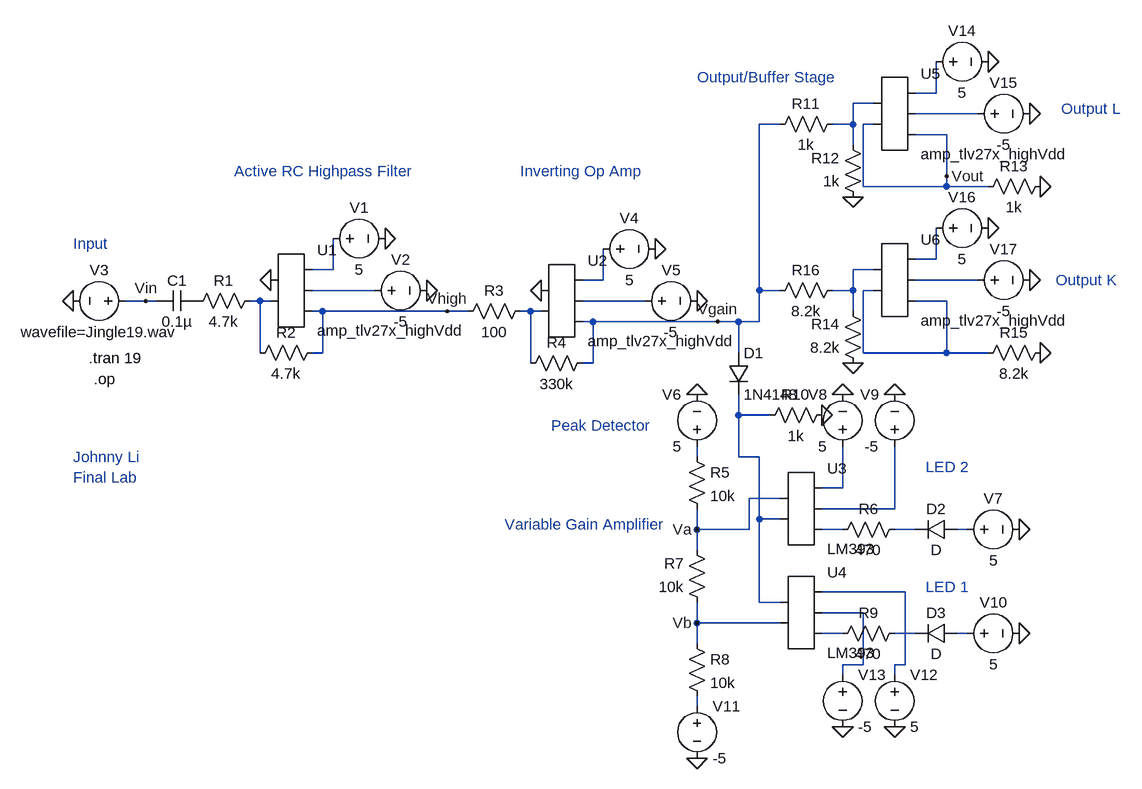
[diagram p0: schematic Lab10.asc]
Lab10.asc, the LTspice schematic file:
Version 4
SHEET 1 1748 968
WIRE 1264 -96 1264 -144
WIRE 1264 -96 1232 -96
WIRE 1168 -80 1136 -80
WIRE 1328 -64 1232 -64
WIRE 1024 -48 992 -48
WIRE 1136 -48 1136 -80
WIRE 1136 -48 1104 -48
WIRE 1168 -48 1152 -48
WIRE 1280 -32 1232 -32
WIRE 1136 -16 1136 -48
WIRE 1280 32 1280 -32
WIRE 1152 48 1152 -48
WIRE 1280 48 1280 32
WIRE 1280 48 1152 48
WIRE 1344 48 1280 48
WIRE 1264 160 1264 112
WIRE 1264 160 1232 160
WIRE 336 176 336 128
WIRE 336 176 304 176
WIRE 1168 176 1136 176
WIRE 752 192 752 144
WIRE 752 192 720 192
WIRE 1328 192 1232 192
WIRE 400 208 304 208
WIRE 992 208 992 -48
WIRE 1024 208 992 208
WIRE 1136 208 1136 176
WIRE 1136 208 1104 208
WIRE 1168 208 1152 208
WIRE 48 224 16 224
WIRE 64 224 48 224
WIRE 224 224 208 224
WIRE 240 224 224 224
WIRE 816 224 720 224
WIRE 1280 224 1232 224
WIRE 320 240 304 240
WIRE 512 240 320 240
WIRE 544 240 512 240
WIRE 640 240 624 240
WIRE 656 240 640 240
WIRE 1136 240 1136 208
WIRE 736 256 720 256
WIRE 928 256 736 256
WIRE 960 256 928 256
WIRE 992 256 992 208
WIRE 992 256 960 256
WIRE 224 304 224 224
WIRE 320 304 320 240
WIRE 320 304 304 304
WIRE 960 304 960 256
WIRE 1152 304 1152 208
WIRE 1280 304 1280 224
WIRE 1280 304 1152 304
WIRE 1344 304 1280 304
WIRE 640 320 640 240
WIRE 736 320 736 256
WIRE 736 320 720 320
WIRE 960 400 960 368
WIRE 1008 400 960 400
WIRE 896 464 896 448
WIRE 960 464 960 400
WIRE 992 464 960 464
WIRE 1120 512 1120 448
WIRE 1120 512 1088 512
WIRE 1024 528 976 528
WIRE 1200 544 1200 448
WIRE 1200 544 1088 544
WIRE 992 560 992 464
WIRE 1024 560 992 560
WIRE 896 576 896 544
WIRE 976 576 976 528
WIRE 976 576 896 576
WIRE 1120 576 1088 576
WIRE 1232 576 1200 576
WIRE 1312 576 1296 576
WIRE 896 608 896 576
WIRE 1216 672 1088 672
WIRE 992 688 992 560
WIRE 1024 688 992 688
WIRE 1152 704 1088 704
WIRE 896 720 896 688
WIRE 1024 720 896 720
WIRE 1120 736 1088 736
WIRE 1232 736 1200 736
WIRE 1312 736 1296 736
WIRE 896 752 896 720
WIRE 1152 784 1152 704
WIRE 1152 784 1120 784
WIRE 1216 784 1216 672
WIRE 1216 784 1200 784
WIRE 1120 800 1120 784
WIRE 1200 800 1200 784
WIRE 896 848 896 832
FLAG 416 128 0
FLAG 480 208 0
FLAG 240 192 0
FLAG -64 224 0
FLAG 48 224 Vin
FLAG 512 240 Vhigh
FLAG 832 144 0
FLAG 896 224 0
FLAG 656 208 0
FLAG 928 256 Vgain
FLAG 896 368 0
FLAG 1392 576 0
FLAG 896 576 Va
FLAG 1120 368 0
FLAG 1200 368 0
FLAG 896 720 Vb
FLAG 1392 736 0
FLAG 896 928 0
FLAG 1200 880 0
FLAG 1120 880 0
FLAG 1088 400 0
FLAG 1344 -144 0
FLAG 1408 -64 0
FLAG 1136 64 0
FLAG 1424 48 0
FLAG 1344 112 0
FLAG 1408 192 0
FLAG 1136 320 0
FLAG 1424 304 0
FLAG 1280 32 Vout
SYMBOL AutoGenerated\\amp_tlv27x_highVdd 272 208 R0
SYMATTR InstName U1
SYMBOL voltage 320 128 R270
WINDOW 0 32 56 VTop 2
WINDOW 3 -32 56 VBottom 2
SYMATTR InstName V1
SYMATTR Value 5
SYMBOL voltage 384 208 R270
WINDOW 0 32 56 VTop 2
WINDOW 3 -32 56 VBottom 2
SYMATTR InstName V2
SYMATTR Value -5
SYMBOL res 224 208 R90
WINDOW 0 0 56 VBottom 2
WINDOW 3 32 56 VTop 2
SYMATTR InstName R1
SYMATTR Value 4.7k
SYMBOL res 320 288 R90
WINDOW 0 0 56 VBottom 2
WINDOW 3 32 56 VTop 2
SYMATTR InstName R2
SYMATTR Value 4.7k
SYMBOL cap 128 208 R90
WINDOW 0 0 32 VBottom 2
WINDOW 3 32 32 VTop 2
SYMATTR InstName C1
SYMATTR Value 0.1µ
SYMBOL voltage 32 224 R90
WINDOW 0 -32 56 VBottom 2
WINDOW 3 32 56 VTop 2
SYMATTR InstName V3
SYMATTR Value wavefile=Jingle19.wav
SYMBOL AutoGenerated\\amp_tlv27x_highVdd 688 224 R0
SYMATTR InstName U2
SYMBOL voltage 736 144 R270
WINDOW 0 32 56 VTop 2
WINDOW 3 -32 56 VBottom 2
SYMATTR InstName V4
SYMATTR Value 5
SYMBOL voltage 800 224 R270
WINDOW 0 32 56 VTop 2
WINDOW 3 -32 56 VBottom 2
SYMATTR InstName V5
SYMATTR Value -5
SYMBOL res 640 224 R90
WINDOW 0 0 56 VBottom 2
WINDOW 3 32 56 VTop 2
SYMATTR InstName R3
SYMATTR Value 100
SYMBOL res 736 304 R90
WINDOW 0 0 56 VBottom 2
WINDOW 3 32 56 VTop 2
SYMATTR InstName R4
SYMATTR Value 330k
SYMBOL diode 944 304 R0
SYMATTR InstName D1
SYMATTR Value 1N4148
SYMBOL voltage 896 464 R180
WINDOW 0 24 96 Left 2
WINDOW 3 24 16 Left 2
SYMATTR InstName V6
SYMATTR Value 5
SYMBOL voltage 1296 576 R270
WINDOW 0 32 56 VTop 2
WINDOW 3 -32 56 VBottom 2
SYMATTR InstName V7
SYMATTR Value 5
SYMBOL res 880 448 R0
SYMATTR InstName R5
SYMATTR Value 10k
SYMBOL AutoGenerated\\LM393 1056 544 R0
SYMATTR InstName U3
SYMBOL voltage 1120 464 R180
WINDOW 0 24 96 Left 2
WINDOW 3 24 16 Left 2
SYMATTR InstName V8
SYMATTR Value 5
SYMBOL voltage 1200 464 R180
WINDOW 0 24 96 Left 2
WINDOW 3 24 16 Left 2
SYMATTR InstName V9
SYMATTR Value -5
SYMBOL res 1216 560 R90
WINDOW 0 0 56 VBottom 2
WINDOW 3 32 56 VTop 2
SYMATTR InstName R6
SYMATTR Value 470
SYMBOL res 912 704 R180
WINDOW 0 36 76 Left 2
WINDOW 3 36 40 Left 2
SYMATTR InstName R7
SYMATTR Value 10k
SYMBOL diode 1296 560 R90
WINDOW 0 0 32 VBottom 2
WINDOW 3 32 32 VTop 2
SYMATTR InstName D2
SYMBOL res 880 736 R0
SYMATTR InstName R8
SYMATTR Value 10k
SYMBOL voltage 1296 736 R270
WINDOW 0 32 56 VTop 2
WINDOW 3 -32 56 VBottom 2
SYMATTR InstName V10
SYMATTR Value 5
SYMBOL AutoGenerated\\LM393 1056 704 R0
SYMATTR InstName U4
SYMBOL res 1216 720 R90
WINDOW 0 0 56 VBottom 2
WINDOW 3 32 56 VTop 2
SYMATTR InstName R9
SYMATTR Value 470
SYMBOL diode 1296 720 R90
WINDOW 0 0 32 VBottom 2
WINDOW 3 32 32 VTop 2
SYMATTR InstName D3
SYMBOL voltage 896 832 R0
SYMATTR InstName V11
SYMATTR Value -5
SYMBOL voltage 1200 784 R0
SYMATTR InstName V12
SYMATTR Value 5
SYMBOL voltage 1120 784 R0
SYMATTR InstName V13
SYMATTR Value -5
SYMBOL res 1104 384 R90
WINDOW 0 0 56 VBottom 2
WINDOW 3 32 56 VTop 2
SYMATTR InstName R10
SYMATTR Value 1k
SYMBOL AutoGenerated\\amp_tlv27x_highVdd 1200 -64 R0
SYMATTR InstName U5
SYMBOL voltage 1248 -144 R270
WINDOW 0 32 56 VTop 2
WINDOW 3 -32 56 VBottom 2
SYMATTR InstName V14
SYMATTR Value 5
SYMBOL voltage 1312 -64 R270
WINDOW 0 32 56 VTop 2
WINDOW 3 -32 56 VBottom 2
SYMATTR InstName V15
SYMATTR Value -5
SYMBOL res 1120 -64 R90
WINDOW 0 0 56 VBottom 2
WINDOW 3 32 56 VTop 2
SYMATTR InstName R11
SYMATTR Value 1k
SYMBOL res 1152 80 R180
WINDOW 0 36 76 Left 2
WINDOW 3 36 40 Left 2
SYMATTR InstName R12
SYMATTR Value 1k
SYMBOL res 1440 32 R90
WINDOW 0 0 56 VBottom 2
WINDOW 3 32 56 VTop 2
SYMATTR InstName R13
SYMATTR Value 1k
SYMBOL AutoGenerated\\amp_tlv27x_highVdd 1200 192 R0
SYMATTR InstName U6
SYMBOL voltage 1248 112 R270
WINDOW 0 32 56 VTop 2
WINDOW 3 -32 56 VBottom 2
SYMATTR InstName V16
SYMATTR Value 5
SYMBOL voltage 1312 192 R270
WINDOW 0 32 56 VTop 2
WINDOW 3 -32 56 VBottom 2
SYMATTR InstName V17
SYMATTR Value -5
SYMBOL res 1152 336 R180
WINDOW 0 36 76 Left 2
WINDOW 3 36 40 Left 2
SYMATTR InstName R14
SYMATTR Value 8.2k
SYMBOL res 1440 288 R90
WINDOW 0 0 56 VBottom 2
WINDOW 3 32 56 VTop 2
SYMATTR InstName R15
SYMATTR Value 8.2k
SYMBOL res 1120 192 R90
WINDOW 0 0 56 VBottom 2
WINDOW 3 32 56 VTop 2
SYMATTR InstName R16
SYMATTR Value 8.2k
TEXT 184 24 Left 2 ;Active RC Highpass Filter
TEXT -64 136 Left 2 ;Input
TEXT 624 24 Left 2 ;Inverting Op Amp
TEXT 1248 664 Left 2 ;LED 1
TEXT 600 568 Left 2 ;Variable Gain Amplifier
TEXT 1248 480 Left 2 ;LED 2
TEXT 896 -120 Left 2 ;Output/Buffer Stage
TEXT 672 416 Left 2 ;Peak Detector
TEXT -40 312 Left 2 !.tran 19
TEXT -32 344 Left 2 !.op
TEXT 1456 -72 Left 2 ;Output L
TEXT 1448 192 Left 2 ;Output K
TEXT -64 464 Left 2 ;Johnny Li
TEXT -64 496 Left 2 ;Final Lab

The netlist it stands for:
* Lab10.asc
* U1: amp_tlv27x_highVdd (symbol AutoGenerated\amp_tlv27x_highVdd not available, pins judged from their places): pin1=0 pin2=N011 pin3=N005 pin4=N009 pin5=Vhigh
V1 N005 0 5
V2 N009 0 -5
R1 N011 P001 4.7k
R2 Vhigh N011 4.7k
C1 P001 Vin 0.1µ
V3 Vin 0 wavefile=Jingle19.wav
* U2: amp_tlv27x_highVdd (symbol AutoGenerated\amp_tlv27x_highVdd not available, pins judged from their places): pin1=0 pin2=N013 pin3=N007 pin4=N012 pin5=Vgain
V4 N007 0 5
V5 N012 0 -5
R3 N013 Vhigh 100
R4 Vgain N013 330k
D1 Vgain N014 1N4148
V6 N015 0 5
V7 N020 0 5
R5 N015 Va 10k
* U3: LM393 (symbol AutoGenerated\LM393 not available, pins judged from their places): pin1=Va pin2=N014 pin3=N016 pin4=N017 pin5=N018
V8 N016 0 5
V9 N017 0 -5
R6 N019 N018 470
R7 Vb Va 10k
D2 N020 N019 D
R8 Vb N026 10k
V10 N025 0 5
* U4: LM393 (symbol AutoGenerated\LM393 not available, pins judged from their places): pin1=N014 pin2=Vb pin3=N021 pin4=N022 pin5=N023
R9 N024 N023 470
D3 N025 N024 D
V11 N026 0 -5
V12 N021 0 5
V13 N022 0 -5
R10 0 N014 1k
* U5: amp_tlv27x_highVdd (symbol AutoGenerated\amp_tlv27x_highVdd not available, pins judged from their places): pin1=N002 pin2=Vout pin3=N001 pin4=N003 pin5=Vout
V14 N001 0 5
V15 N003 0 -5
R11 N002 Vgain 1k
R12 0 N002 1k
R13 0 Vout 1k
* U6: amp_tlv27x_highVdd (symbol AutoGenerated\amp_tlv27x_highVdd not available, pins judged from their places): pin1=N006 pin2=N010 pin3=N004 pin4=N008 pin5=N010
V16 N004 0 5
V17 N008 0 -5
R14 0 N006 8.2k
R15 0 N010 8.2k
R16 N006 Vgain 8.2k
.model D D
.lib standard.dio
* Active RC Highpass Filter
* Input
* Inverting Op Amp
* LED 1
* Variable Gain Amplifier
* LED 2
* Output/Buffer Stage
* Peak Detector
.tran 19
.op
* Output L
* Output K
* Johnny Li
* Final Lab
.backanno
.end